# Altium project switchboard.PrjPcb
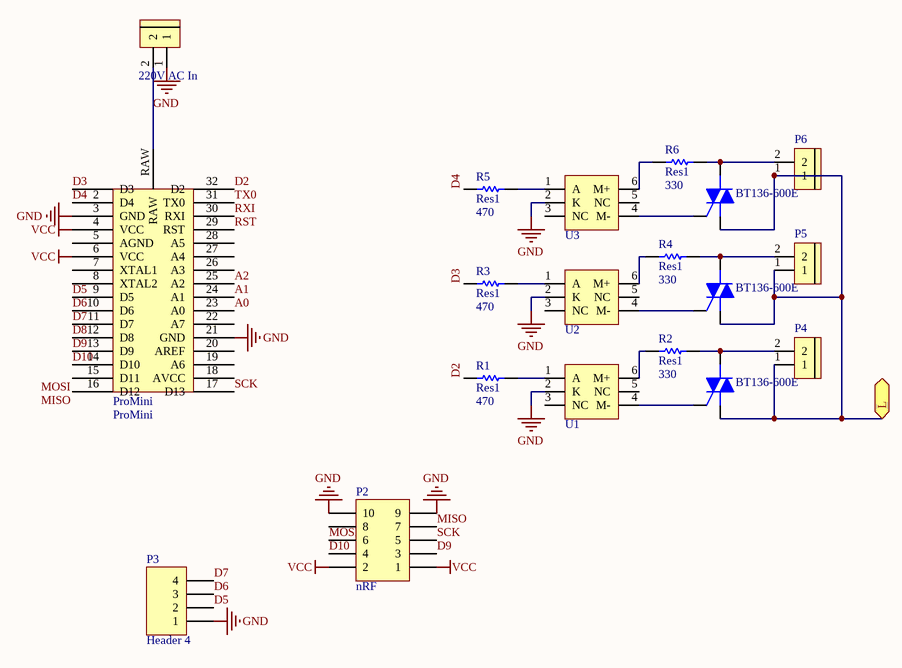
[diagram p0: switchboard_schematic.SchDoc]
1 sheet, 19 parts. Net scope: flat (ports and power ports of the same name join across sheets).
Board file: switchboard_pcb.PcbDoc

## Sheet switchboard_schematic.SchDoc
size A

### Parts
P1  220V AC In  [BIG_Header 2]
P2  nRF  [HDR2X5]
P3  Header 4  [HDR1X4]
P4  BIG_Header 2  [BIG_Header 2]  (value not drawn)
P5  BIG_Header 2  [BIG_Header 2]  (value not drawn)
P6  BIG_Header 2  [BIG_Header 2]  (value not drawn)
ProMini  ProMini  [Arduino Pro Mini]
Q1  BT136-600E  [BTA6-600]
Q2  BT136-600E  [BTA6-600]
Q3  BT136-600E  [BTA6-600]
R1  Res1  value 470  [AXIAL-0.3]
R2  Res1  value 330  [AXIAL-0.3]
R3  Res1  value 470  [AXIAL-0.3]
R4  Res1  value 330  [AXIAL-0.3]
R5  Res1  value 470  [AXIAL-0.3]
R6  Res1  value 330  [AXIAL-0.3]
U1  MOC3021M  [MOC30XX]  (value not drawn)
U2  MOC3021M  [MOC30XX]  (value not drawn)
U3  MOC3021M  [MOC30XX]  (value not drawn)

### Ports
L

### Nets
GND: P1.1 P2.9 P2.10 P3.1 ProMini.3(GND) ProMini.21(GND) U1.2(K) U2.2(K) U3.2(K)
VCC: P2.1 P2.2 ProMini.4(VCC) ProMini.6(VCC)
A0: ProMini.23(A0)
A1: ProMini.24(A1)
A2: ProMini.25(A2)
D2: ProMini.32(D2) R1.1
D3: ProMini.1(D3) R3.1
D4: ProMini.2(D4) R5.1
D5: P3.2 ProMini.9(D5)
D6: P3.3 ProMini.10(D6)
D7: P3.4 ProMini.11(D7)
D8: ProMini.12(D8)
D9: P2.3 ProMini.13(D9)
D10: P2.4 ProMini.14(D10)
MISO: P2.7 ProMini.16(D12)
MOSI: P2.6 ProMini.15(D11)
RST: ProMini.29(RST)
RXI: ProMini.30(RXI)
SCK: P2.5 ProMini.17(D13)
TX0: ProMini.31(TX0)
NetP1_2: P1.2 ProMini.RAW
NetP4_1: P4.1 P5.1 P6.1 Q1.1(M1) Q2.1(M1) Q3.1(M1) ; port L
NetP4_2: P4.2 Q1.2(M2) R2.2
NetP5_2: P5.2 Q2.2(M2) R4.2
NetP6_2: P6.2 Q3.2(M2) R6.2
NetQ1_3: Q1.3(G) U1.4(M-)
NetQ2_3: Q2.3(G) U2.4(M-)
NetQ3_3: Q3.3(G) U3.4(M-)
NetR1_2: R1.2 U1.1(A)
NetR2_1: R2.1 U1.6(M+)
NetR3_2: R3.2 U2.1(A)
NetR4_1: R4.1 U2.6(M+)
NetR5_2: R5.2 U3.1(A)
NetR6_1: R6.1 U3.6(M+)

Not connected (* = marked no-connect by the designer): P2 8; ProMini 5(AGND) 7(XTAL1) 8(XTAL2) 18(AVCC) 19(A6) 20(AREF) 22(A7) 26(A3) 27(A4) 28(A5); U1 3(NC) 5(NC); U2 3(NC) 5(NC); U3 3(NC) 5(NC)

### Library data of the parts
P1 = BIG_Header 2
P2 = Header 5X2: Header, 5-Pin, Dual row; LatestRevisionDate: 17-Jul-2002; LatestRevisionNote: Re-released for DXP Platform.; Publisher: Altium Limited
P3 = Header 4: Header, 4-Pin; LatestRevisionDate: 17-Jul-2002; LatestRevisionNote: Re-released for DXP Platform.; Publisher: Altium Limited
ProMini = Pro Mini
Q1-Q3 = BTA12-600: Silicon Bidirectional Triode Thyristor; Note: Pin 2 is electrically connected to Pin 4 (TAB); Published: 29-Sep-2000; LatestRevisionDate: 17-Jul-2002; LatestRevisionNote: Re-released for DXP Platform.; DatasheetDocument: 1999; PackageReference: 369-03; Publisher: Altium Limited; Code_JEDEC: TO-251-AA; ComponentLink1Description: Manufacturer Link; ComponentLink1URL: http://www.motorola.com/
R1-R6 = Res1: Resistor; Published: 8-Jun-2000; LatestRevisionDate: 17-Jul-2002; LatestRevisionNote: Re-released for DXP Platform.; PackageReference: AXIAL-0.3; Publisher: Altium Limited; PackageDescription: Axial Device, Thru-Hole; 2 Leads; 0.3 in Pin Spacing